# Altium schematic sheet ESP32_temperature_gun.SchDoc
size A4; SheetNumber: 1; SheetTotal: 1
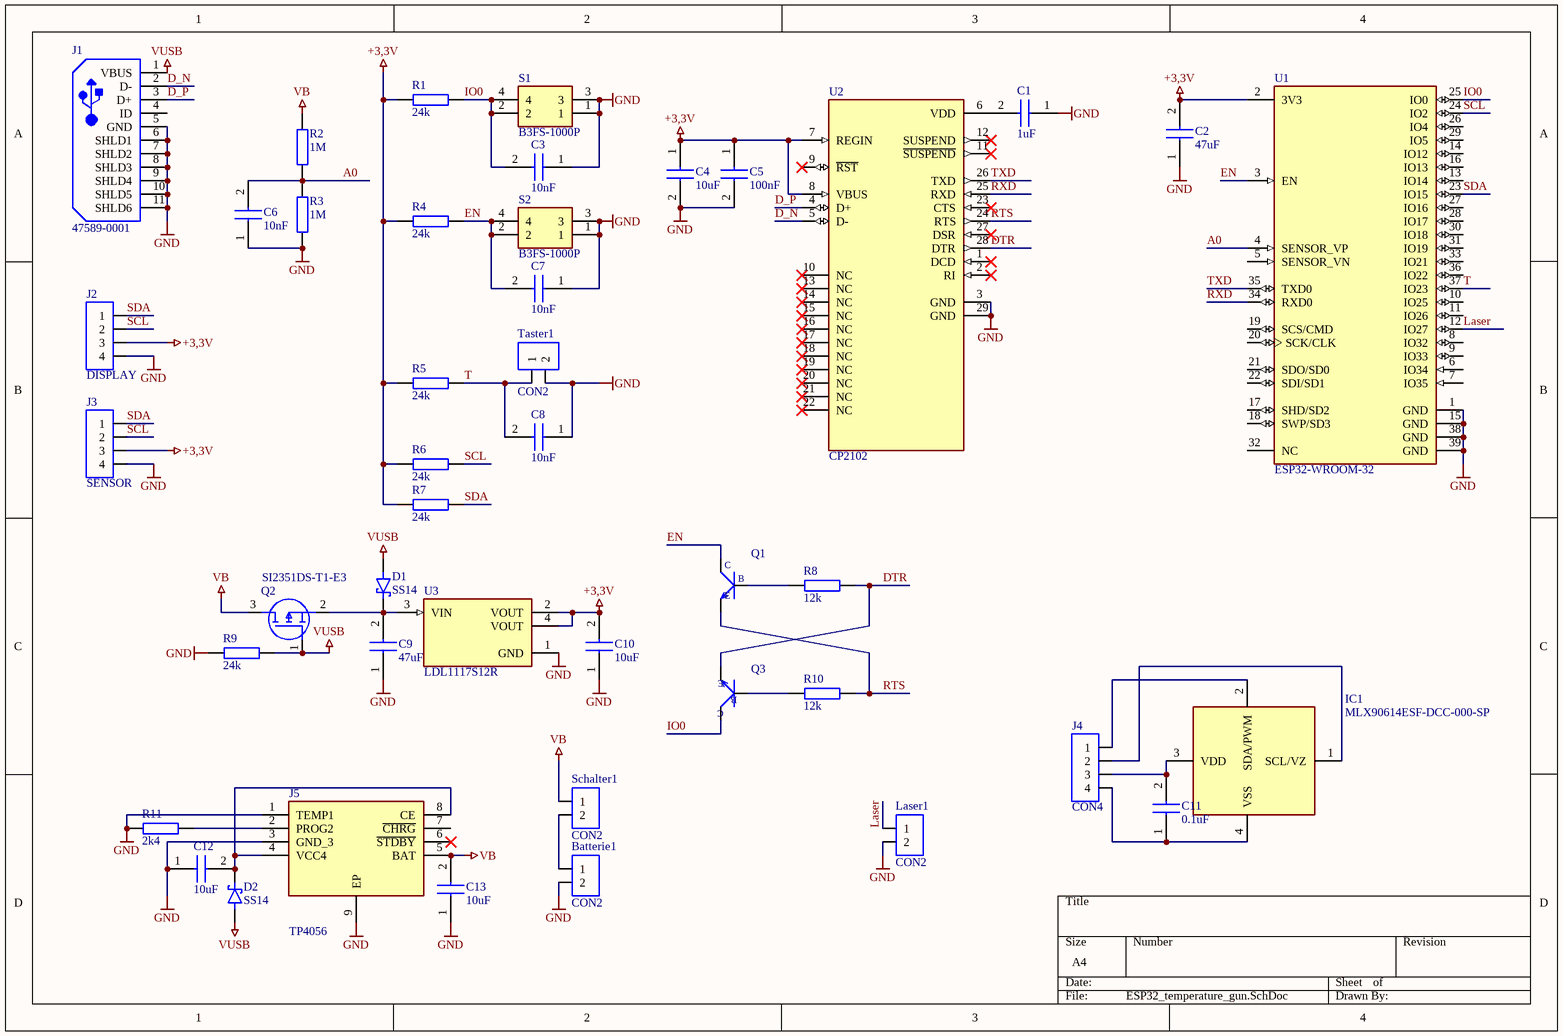
[diagram p0: ESP32_temperature_gun.SchDoc]

## Parts
Batterie1  CON2  [SIP-2]
C1  1uF  [CAPC2013X140N]
C2  47uF  [CAPC2013X140N]
C3  10nF  [CAPC2013X140N]
C4  10uF  [CAPC2013X140N]
C5  100nF  [CAPC2013X140N]
C6  10nF  [CAPC2013X140N]
C7  10nF  [CAPC2013X140N]
C8  10nF  [CAPC2013X140N]
C9  47uF  [CAPC2013X140N]
C10  10uF  [CAPC2013X140N]
C11  0.1uF  [CAPC2013X140N]
C12  10uF  [CAPC2013X140N]
C13  10uF  [CAPC2013X140N]
D1  SS14  [DIOM4325X250N]
D2  SS14  [DIOM4325X250N]
IC1  MLX90614ESF-DCC-000-SP  [MLX90614ESFDCC000SP]
J1  47589-0001  [USB-MICRO-B_V - RZEP_CN]
J2  DISPLAY  [Sip-4]
J3  SENSOR  [Sip-4]
J4  CON4  [Sip-4]
J5  TP4056  [SOIC127P600X175-9N]
Laser1  CON2  [SIP-2]
Q1  SMD-TRANSISTORS-NPN-25V-500MW(SOT-23)  [SOT-23]  (value not drawn)
Q2  SI2351DS-T1-E3  [SOT95P237X112-3N]
Q3  SMD-TRANSISTORS-NPN-25V-500MW(SOT-23)  [SOT-23]  (value not drawn)
R1  24k  [RESC1608X55N]
R2  1M  [RESC1608X55N]
R3  1M  [RESC1608X55N]
R4  24k  [RESC1608X55N]
R5  24k  [RESC1608X55N]
R6  24k  [RESC1608X55N]
R7  24k  [RESC1608X55N]
R8  12k  [RESC1608X55N]
R9  24k  [RESC1608X55N]
R10  12k  [RESC1608X55N]
R11  2k4  [RESC1608X55N]
S1  B3FS-1000P  [B3FS-1000P]
S2  B3FS-1000P  [B3FS-1000P]
Schalter1  CON2  [SIP-2]
Taster1  CON2  [SIP-2]
U1  ESP32-WROOM-32  [MODULE_ESP32-WROOM-32]
U2  CP2102  [QFN50P500X500X100-29N]
U3  LDL1117S12R  [SOT230P700X180-4N]

## Nets
+3,3V: C2.2(C1) C4.1(C2) C5.1(C2) C10.2(C1) J2.3 J3.3 R1.1 R4.1 R5.1 R6.1 R7.1 U1.2(3V3) U2.7(REGIN) U2.8(VBUS) U3.2(VOUT) U3.4(VOUT)
GND: Batterie1.2 C1.1(C2) C2.1(C2) C3.1(C2) C4.2(C1) C5.2(C1) C6.1(C2) C7.1(C2) C8.1(C2) C9.1(C2) C10.1(C2) C12.1(C2) C13.1(C2) J1.5(GND) J1.6(SHLD1) J1.7(SHLD2) J1.8(SHLD3) J1.9(SHLD4) J1.10(SHLD5) J1.11(SHLD6) J2.4 J3.4 J5.1(TEMP1) J5.3(GND_3) J5.9(EP) Laser1.2 R3.1 R9.1 R11.1 S1.1 S1.3 S2.1 S2.3 Taster1.2 U1.1(GND) U1.15(GND) U1.38(GND) U1.39(GND) U2.3(GND) U2.29(GND) U3.1(GND)
VB: C13.2(C1) J5.5(BAT) Q2.3(D) R2.2 Schalter1.1
VUSB: D1.A D2.A J1.1(VBUS) Q2.1(G) R9.2
A0: C6.2(C1) R2.1 R3.2 U1.4(SENSOR_VP)
D_N: J1.2(D-) U2.5(D-)
D_P: J1.3(D+) U2.4(D+)
DTR: Q3.2(E) R8.2 U2.28(DTR)
EN: C7.2(C1) Q1.3(C) R4.2 S2.2 S2.4 U1.3(EN)
IO0: C3.2(C1) Q3.3(C) R1.2 S1.2 S1.4 U1.25(IO0)
Laser: Laser1.1 U1.12(IO27)
RTS: Q1.2(E) R10.2 U2.24(RTS)
RXD: U1.34(RXD0) U2.25(RXD)
SCL: J2.2 J3.2 R6.2 U1.24(IO2)
SDA: J2.1 J3.1 R7.2 U1.23(IO15)
T: C8.2(C1) R5.2 Taster1.1 U1.37(IO23)
TXD: U1.35(TXD0) U2.26(TXD)
NetBatterie1_1: Batterie1.1 Schalter1.2
NetC1_2: C1.2(C1) U2.6(VDD)
NetC9_2: C9.2(C1) D1.C(K) Q2.2(S) U3.3(VIN)
NetC11_1: C11.1(C2) IC1.4(VSS) J4.4
NetC11_2: C11.2(C1) IC1.3(VDD) J4.3
NetC12_2: C12.2(C1) D2.C(K) J5.4(VCC4) J5.8(CE)
NetIC1_1: IC1.1(SCL/VZ) J4.2
NetIC1_2: IC1.2(SDA/PWM) J4.1
NetJ5_2: J5.2(PROG2) R11.2
NetQ1_1: Q1.1(B) R8.1
NetQ3_1: Q3.1(B) R10.1

Not connected (* = marked no-connect by the designer): J1 4(ID); J5 6(~{STDBY})* 7(~{CHRG}); U1 5(SENSOR_VN) 6(IO34) 7(IO35) 8(IO32) 9(IO33) 10(IO25) 11(IO26) 13(IO14) 14(IO12) 16(IO13) 17(SHD/SD2) 18(SWP/SD3) 19(SCS/CMD) 20(SCK/CLK) 21(SDO/SD0) 22(SDI/SD1) 26(IO4) 27(IO16) 28(IO17) 29(IO5) 30(IO18) 31(IO19) 32(NC) 33(IO21) 36(IO22); U2 1(DCD)* 2(RI)* 9(~{RST})* 10(NC)* 11(~{SUSPEND})* 12(SUSPEND)* 13(NC)* 14(NC)* 15(NC)* 16(NC)* 17(NC)* 18(NC)* 19(NC)* 20(NC)* 21(NC)* 22(NC)* 23(CTS)* 27(DSR)*

## Library data of the parts
Batterie1 Laser1 Schalter1 Taster1 = CON2: Stecker
C1-C13 = 08053D106KAT2A: Capacitor; Manufacturer_Name: Kyocera AVX; Datasheet Link: http://componentsearchengine.com/Datasheets/1/08053D106KAT2A.pdf; Manufacturer_Part_Number: 08053D106KAT2A; Mouser Part Number: 581-08053D106KAT2A; Mouser Price/Stock: https://www.mouser.co.uk/ProductDetail/AVX/08053D106KAT2A?qs=RC%2FTMc7rOJbkID75Q0PA3w%3D%3D; Arrow Part Number: 08053D106KAT2A; Arrow Price/Stock: https://www.arrow.com/en/products/08053d106kat2a/avx
D1 D2 = SS14: MF: {'manufacturer': u'Taiwan Semiconductor'}; Package: None; Price: None; Value: *; MP: SS14; Availability: Unavailable
IC1 = MLX90614ESF-DCC-000-SP: Integrated Circuit; Manufacturer_Name: Melexis; Datasheet Link: https://www.mouser.com/datasheet/2/734/MLX90614-Datasheet-Melexis-953298.pdf; Height: 17.35mm; Manufacturer_Part_Number: MLX90614ESF-DCC-000-SP; Mouser Part Number: 482-90614ESFDCC000SP; Mouser Price/Stock: https://www.mouser.co.uk/ProductDetail/Melexis/MLX90614ESF-DCC-000-SP?qs=KuGPmAKtFKVd5ey8TnlzAw%3D%3D; Arrow Part Number: MLX90614ESF-DCC-000-SP; Arrow Price/Stock: https://www.arrow.com/en/products/mlx90614esf-dcc-000-sp/melexis?region=nac
J1 = USB_CMP-2000-05610-1: Right Angle Female Type AB Micro USB Connector, 30 V, 1.8 A, -30 to 85 degC, RoHS, Tape and Reel; Number of Ports: 1Port; Current Rating: 1.8A; Brand: Molex; Connector Type: MicroUSBTypeABreceptacle; Number of Contacts: 5Contact; Voltage Rating: 30VAC; Color: Black; Product: MicroUSBTypeABConnectors; Package URL: http://www.molex.com/pdm_docs/sd/475890001_sd.pdf; Contact Plating: Gold; Datasheet URL: http://www.molex.com/webdocs/datasheets/pdf/en-us/0475890001_IO_CONNECTORS.pdf; Operating Temperature Range: -20Cto+85C; Termination Style: SMD/SMT; Mounting Angle: Right; Package Reference: 47589-0001; Gender: Female; Package Description: Micro USB Connector, Pitch 0.65 mm, 5 Positions, Body 7.5 x 5.6 mm; Mounting Technology: SurfaceMount; Contact Material: CopperAlloy; Packaging: Reel; RoHS: True; Standard: USB; Manufacturer URL: http://www.molex.com/; Manufacturer: Molex; Datasheet Version: 12/2016; Product Category: USBConnectors; Series: 47589
J2-J4 = CON4: Stecker
J5 = TP4056: Connector; Manufacturer_Name: NanJing Top Power; Datasheet Link: https://dlnmh9ip6v2uc.cloudfront.net/datasheets/Prototyping/TP4056.pdf; Height: 1.75mm; Manufacturer_Part_Number: TP4056
Q1 Q3 = SMD-TRANSISTORS-NPN-25V-500MW(SOT-23): 305010017; MF: {'manufacturer': u'MDD'}; MP: S8050; Package: None; Price: None; Value: *; Availability: Unavailable
Q2 = SI2351DS-T1-E3: MOSFET (P-Channel); Manufacturer_Name: Vishay; Datasheet Link: http://www.vishay.com/docs/73702/si2351ds.pdf; Height: 1.12mm; Manufacturer_Part_Number: SI2351DS-T1-E3; Mouser Part Number: 781-SI2351DS-E3; Mouser Price/Stock: https://www.mouser.co.uk/ProductDetail/Vishay-Siliconix/SI2351DS-T1-E3?qs=G1LhLIAbs1wtac0vldSihQ%3D%3D
R1-R11 = RES: Widerstand
S1 S2 = B3FS-1000P: Switch; Manufacturer_Name: Omron Electronics; Datasheet Link: https://www.omron.co.jp/ecb/products/pdf/b3fs.pdf; Manufacturer_Part_Number: B3FS-1000P; Mouser Part Number: 653-B3FS-1000P; Mouser Price/Stock: https://www.mouser.co.uk/ProductDetail/Omron-Electronics/B3FS-1000P?qs=ImaqFqjHA4k6odVF2%2FXWpQ%3D%3D; Arrow Part Number: B3FS-1000P; Arrow Price/Stock: https://www.arrow.com/en/products/b3fs-1000p/omron?region=nac
U1 = ESP32-WROOM-32: Bluetooth, WiFi 802.11b/g/n, Bluetooth v4.2 +EDR, Class 1, 2 and 3 Transceiver Module 2.4GHz ~ 2.5GHz Antenna Not Included, U.FL Surface Mount; MF: Espressif Systems; Price: None; Availability: In Stock; MP: ESP32-WROOM-32; Package: Module Espressif Systems; SnapEDA_Link: https://www.snapeda.com/parts/ESP32-WROOM-32/Espressif+Systems/view-part/?ref=snap; Check_prices: https://www.snapeda.com/parts/ESP32-WROOM-32/Espressif+Systems/view-part/?ref=eda; Value: *; Purchase-URL: https://pricing.snapeda.com/search/part/ESP32-WROOM-32/?ref=eda
U2 = CP2102: USB to UART Bridge; MF: {'manufacturer': u'Silicon Labs'}; Package: None; Price: None; Value: *; MP: CP2102; Availability: Unavailable
U3 = LDL1117S12R: MF: {'manufacturer': u'STMicroelectronics'}; Package: None; Price: None; Value: *; MP: LDL1117S12R; Availability: Unavailable